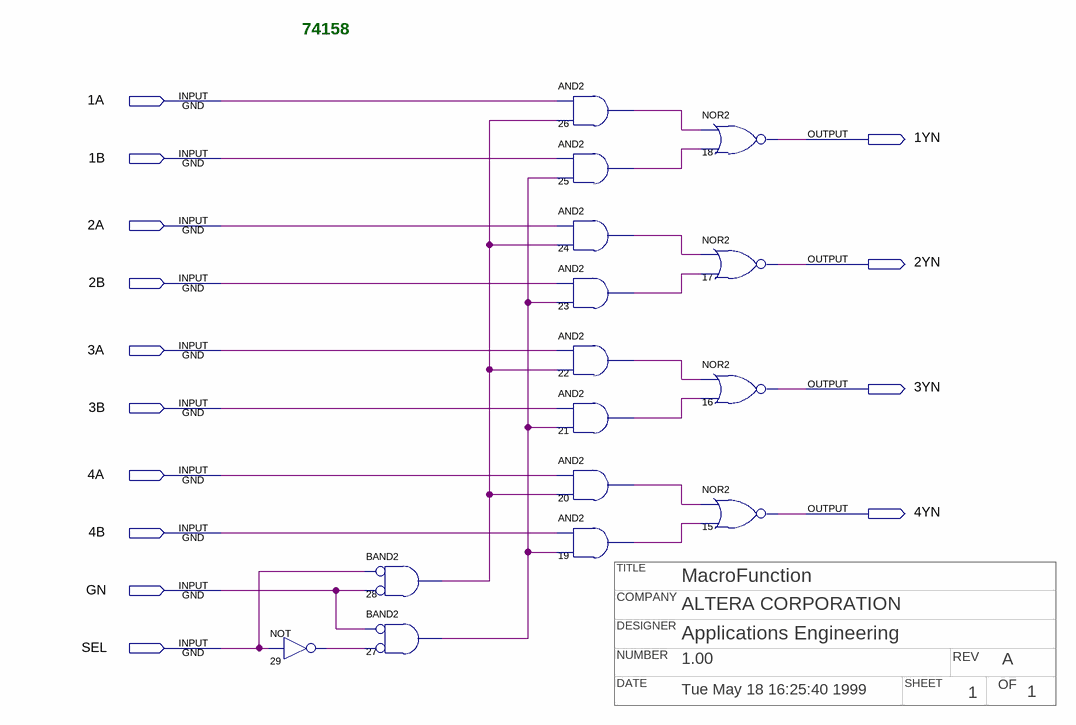
[diagram p0: schematic sheet]
// Quartus schematic 74158.bdf as structural Verilog: 15 symbols, 14 pins
// Title block: TITLE: MacroFunction; COMPANY: ALTERA CORPORATION; DESIGNER: Applications Engineering; NUMBER: 1.00; REV: A; DATE: Tue May 18 16:25:40 1999; SHEET: 1; OF: 1
module \74158  (
  input  \1A ,
  input  \1B ,
  input  \2A ,
  input  \2B ,
  input  \3A ,
  input  \3B ,
  input  \4A ,
  input  \4B ,
  input  GN,
  input  SEL,
  output \1YN ,
  output \2YN ,
  output \3YN ,
  output \4YN 
);

  wire n19_out, n20_out, n21_out, n22_out, n23_out, n24_out, n25_out, n26_out, n27_out, n28_out, n29_out;

  not u_29 (n29_out, SEL);
  and u_28 (n28_out, ~SEL, ~GN);  // BAND2
  and u_27 (n27_out, ~GN, ~n29_out);  // BAND2
  and u_26 (n26_out, \1A , n28_out);
  and u_25 (n25_out, \1B , n27_out);
  and u_24 (n24_out, \2A , n28_out);
  and u_23 (n23_out, \2B , n27_out);
  and u_22 (n22_out, \3A , n28_out);
  and u_21 (n21_out, \3B , n27_out);
  and u_20 (n20_out, \4A , n28_out);
  and u_19 (n19_out, \4B , n27_out);
  nor u_18 (\1YN , n26_out, n25_out);
  nor u_17 (\2YN , n24_out, n23_out);
  nor u_16 (\3YN , n22_out, n21_out);
  nor u_15 (\4YN , n20_out, n19_out);

  // Notes on the sheet:
  //   74158
endmodule
